# EAGLE design ADC (EAGLE 9.2.0)
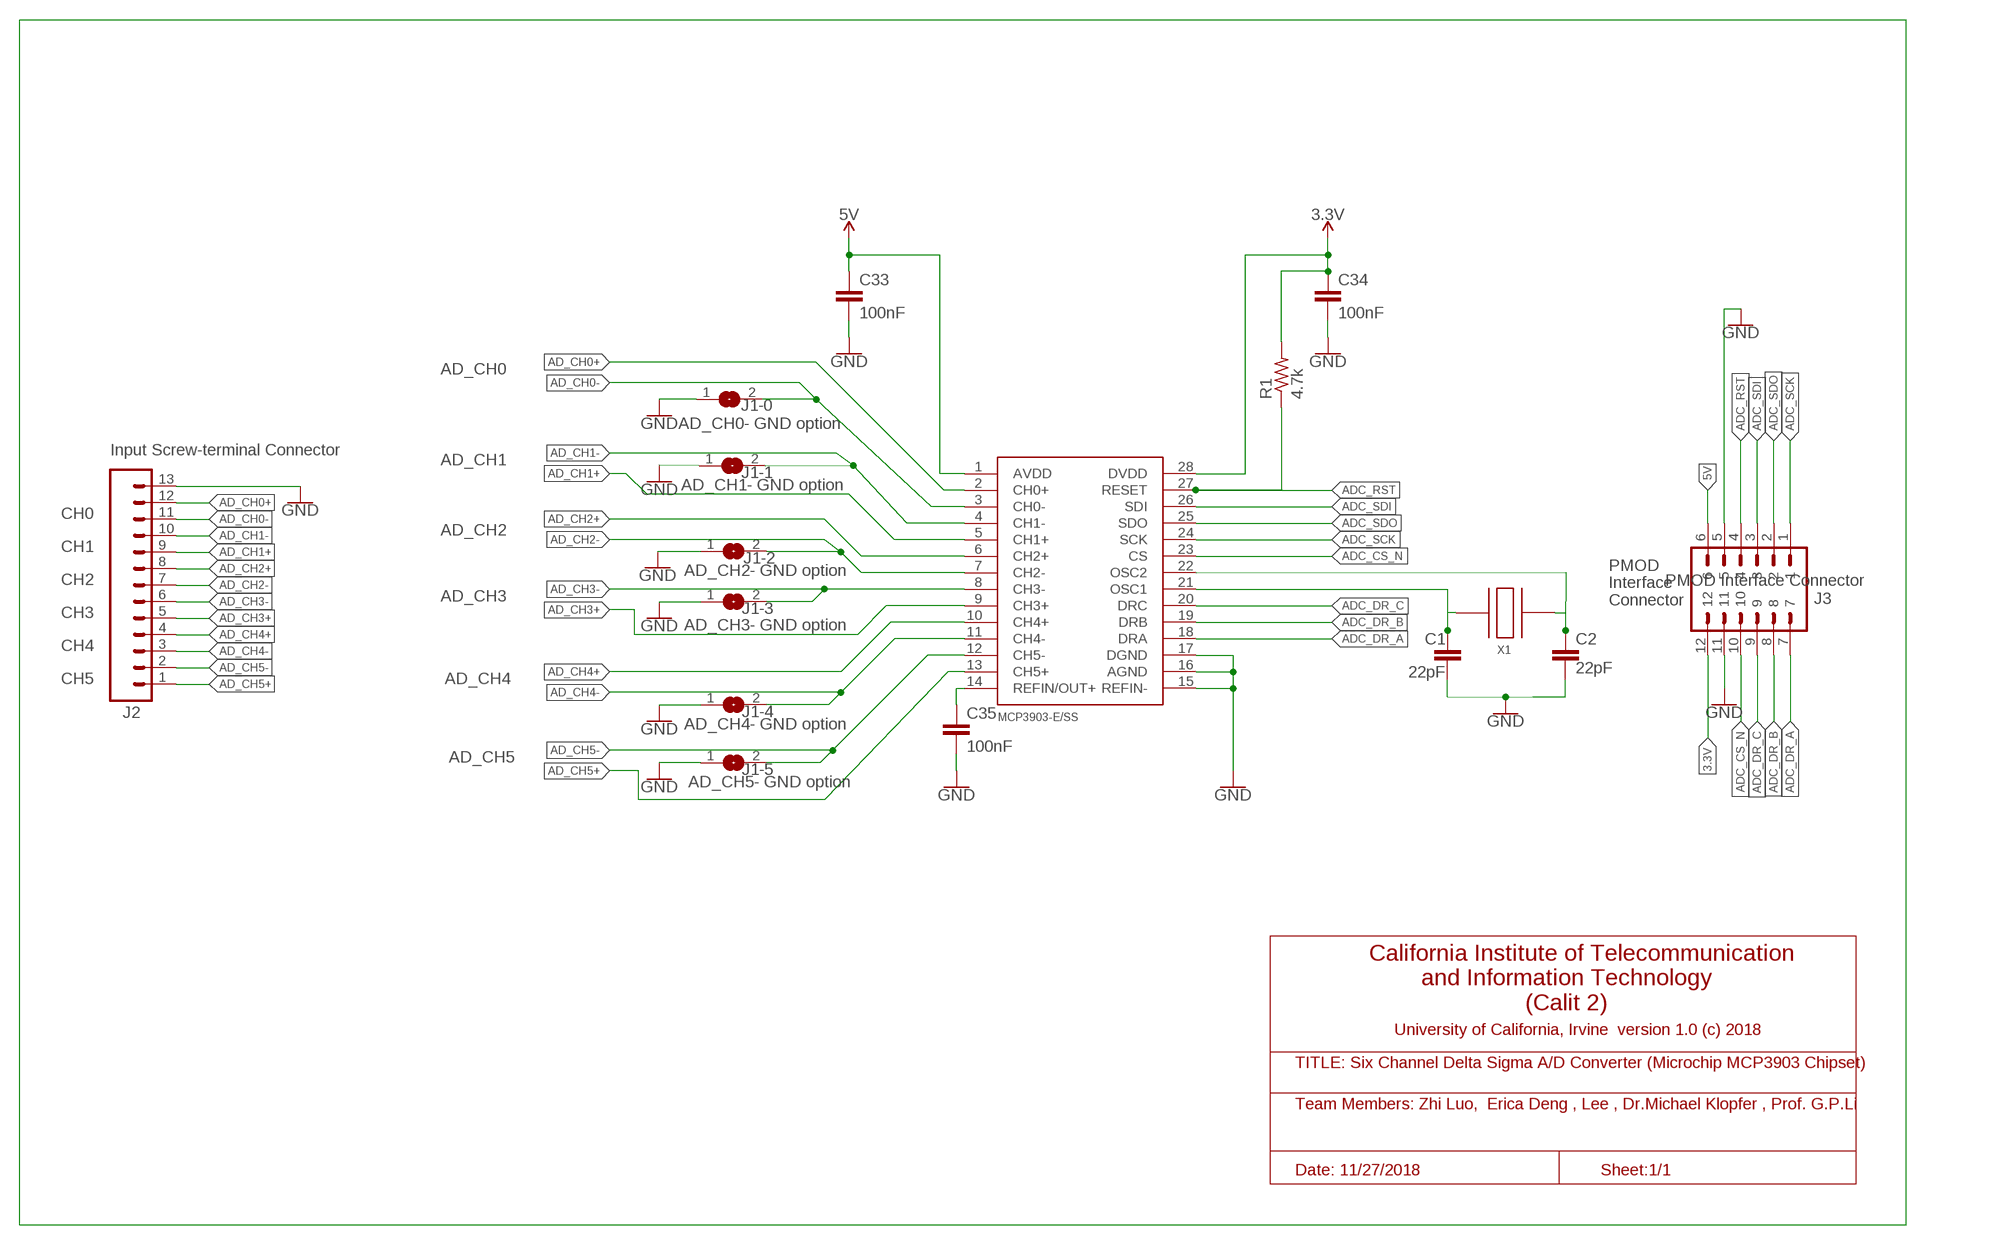
[diagram p0: schematic, sheet 1]

## Parts
C1  22pF  22PF-0603-50V-5%  [0603]
C2  22pF  22PF-0603-50V-5%  [0603]
C33  100nF  CC0603  [C0603]
C34  100nF  CC0603  [C0603]
C35  100nF  CC0603  [C0603]
J1-0  AD_CH0- GND option  SJ  [SJ]
J1-1  AD_CH1- GND option  SJ  [SJ]
J1-2  AD_CH2- GND option  SJ  [SJ]
J1-3  AD_CH3- GND option  SJ  [SJ]
J1-4  AD_CH4- GND option  SJ  [SJ]
J1-5  AD_CH5- GND option  SJ  [SJ]
J2  Input Screw-terminal Connector  CONN_13  [1X13]
J3  PMOD Interface Connector  26HEADER  [2*6HEADER]
R1  4.7k  0402-RES  [0402-RES]
U$1  MCP3903  [28-LEADSSOP]
X1  4MHZ  QUARTZ_3.58M_2PIN  [HC-49S]

## Nets
3.3V: C34.1 J3.12 R1.2 U$1.28(DVDD)
5V: C33.1 J3.6 U$1.1(AVDD)
AD_CH0+: J2.12 U$1.2(CH0+)
AD_CH0-: J1-0.2 J2.11 U$1.3(CH0-)
AD_CH1+: J2.9 U$1.5(CH1+)
AD_CH1-: J1-1.2 J2.10 U$1.4(CH1-)
AD_CH2+: J2.8 U$1.6(CH2+)
AD_CH2-: J1-2.2 J2.7 U$1.7(CH2-)
AD_CH3+: J2.5 U$1.9(CH3+)
AD_CH3-: J1-3.2 J2.6 U$1.8(CH3-)
AD_CH4+: J2.4 U$1.10(CH4+)
AD_CH4-: J1-4.2 J2.3 U$1.11(CH4-)
AD_CH5+: J2.1 U$1.13(CH5+)
AD_CH5-: J1-5.2 J2.2 U$1.12(CH5-)
ADC_CS_N: J3.10 U$1.23(CS)
ADC_DR_A: J3.7 U$1.18(DRA)
ADC_DR_B: J3.8 U$1.19(DRB)
ADC_DR_C: J3.9 U$1.20(DRC)
ADC_RST: J3.4 R1.1 U$1.27(RESET)
ADC_SCK: J3.1 U$1.24(SCK)
ADC_SDI: J3.3 U$1.26(SDI)
ADC_SDO: J3.2 U$1.25(SDO)
GND: C1.2 C33.2 C34.2 C35.2 J1-0.1 J1-1.1 J1-2.1 J1-3.1 J1-4.1 J1-5.1 J2.13 J3.5 J3.11 U$1.15(REFIN-) U$1.16(AGND) U$1.17(DGND)
N$1: C2.2
N$2: C35.1 U$1.14(REFIN/OUT+)
OSC_1: C1.1 U$1.21(OSC1) X1.1
OSC_2: C2.1 U$1.22(OSC2) X1.2

## Notes on the sheet
- AD_CH0
- AD_CH1
- CH0
- AD_CH2
- CH1
- CH2
- AD_CH3
- PMOD 
  Interface
  Connector
- CH3
- CH4
- CH5 | AD_CH4
- AD_CH5
- California Institute of Telecommunication 
          and Information Technology 
                          (Calit 2)
- University of California, Irvine  version 1.0 (c) 2018
- TITLE: Six Channel Delta Sigma A/D Converter (Microchip MCP3903 Chipset)
- Team Members: Zhi Luo,  Erica Deng , Lee , Dr.Michael Klopfer , Prof. G.P.Li
- Date: 11/27/2018 | Sheet:1/1

## Library data of the parts
C1 C2 = SparkFun-Capacitors:22PF: 22pF ceramic capacitors A capacitor is a passive two-terminal electrical component used to store electrical energy temporarily in an electric field.; PROD_ID: CAP-07876
C33-C35 = eagle-ltspice:C: CAPACITOR, European symbol; SPICEMODEL: NONE; SPICEPREFIX: C
J1-0 J1-1-J1-5 = jumper:SJ: SMD solder JUMPER
J2 = SparkFun-Connectors:CONN_13: Multi connection point. Often used as Generic Header-pin footprint for 0.1 inch spaced/style header connections On any of the 0.1 inch spaced packages, you can populate with these: Break Away Headers - Straight <https://www.sparkfun.com/products/116> (PRT-00116) Break Away Male Headers - Right Angle <https://www.sparkfun.com/products/553> (PRT-00553) Female Headers <https://www.sparkfun.com/products/115> (PRT-00115) Break Away Headers - Machine Pin <https://www.sparkfun.com/products/117> (PRT-00117) Break Away Female Headers - Swiss Machine Pin <https://www.sparkfun.com/products/743> (PRT-00743) For SCREWTERMINALS and SPRING TERMINALS visit here: Screw Terimnals on SparkFun.com <https://www.sparkfun.com/search/results?term=Screw+Terminals> (5mm/3.5mm/2.54mm spacing) This device is also useful as a general connection point to wire up your design to another part of your project. Our various solder wires solder well into these plated through hole pads. Hook-Up Wire - Assortment (Stranded, 22 AWG) <https://www.sparkfun.com/products/11375> (PRT-11375) Hook-Up Wire - Assortment (Solid Core, 22 AWG) <https://www.sparkfun.com/products/11367> (PRT-11367) View the entire wire category on our website here <https://www.sparkfun.com/categories/141> Special notes: Molex polarized connector foot print use with SKU : PRT-08231 with associated crimp pins and housings. 1MM SMD Version SKU: PRT-10208 NOTES ON THE VARIANTS LOCK and LOCK_LONGPADS... This footprint was designed to help hold the alignment of a through-hole component (i.e. 6-pin header) while soldering it into place. You may notice that each hole has been shifted either up or down by 0.005 of an inch from it's more standard position (which is a perfectly straight line). This slight alteration caused the pins (the squares in the middle) to touch the edges of the holes. Because they are alternating, it causes a "brace" to hold the component in place. 0.005 has proven to be the perfect amount of "off-center" position when using our standard breakaway headers. Although looks a little odd when you look at the bare footprint, once you have a header in there, the alteration is very hard to notice. Also,if you push a header all the way into place, it is covered up entirely on the bottom side.
J3 = MCP3903:2*6HEADER
R1 = Nizanlib:0402-RES
U$1 = MCP3903:MCP3903
X1 = CalPlug:QUARTZ_3.58M_2PIN; DIGIKEY: http://www.digikey.com/product-detail/en/txc-corporation/9C-3.579545MBBK-T/887-2450-1-ND/4475440

## Net classes
0 default: width 0.305 mm, drill 0.508 mm, clearance 0.254 mm

## Board
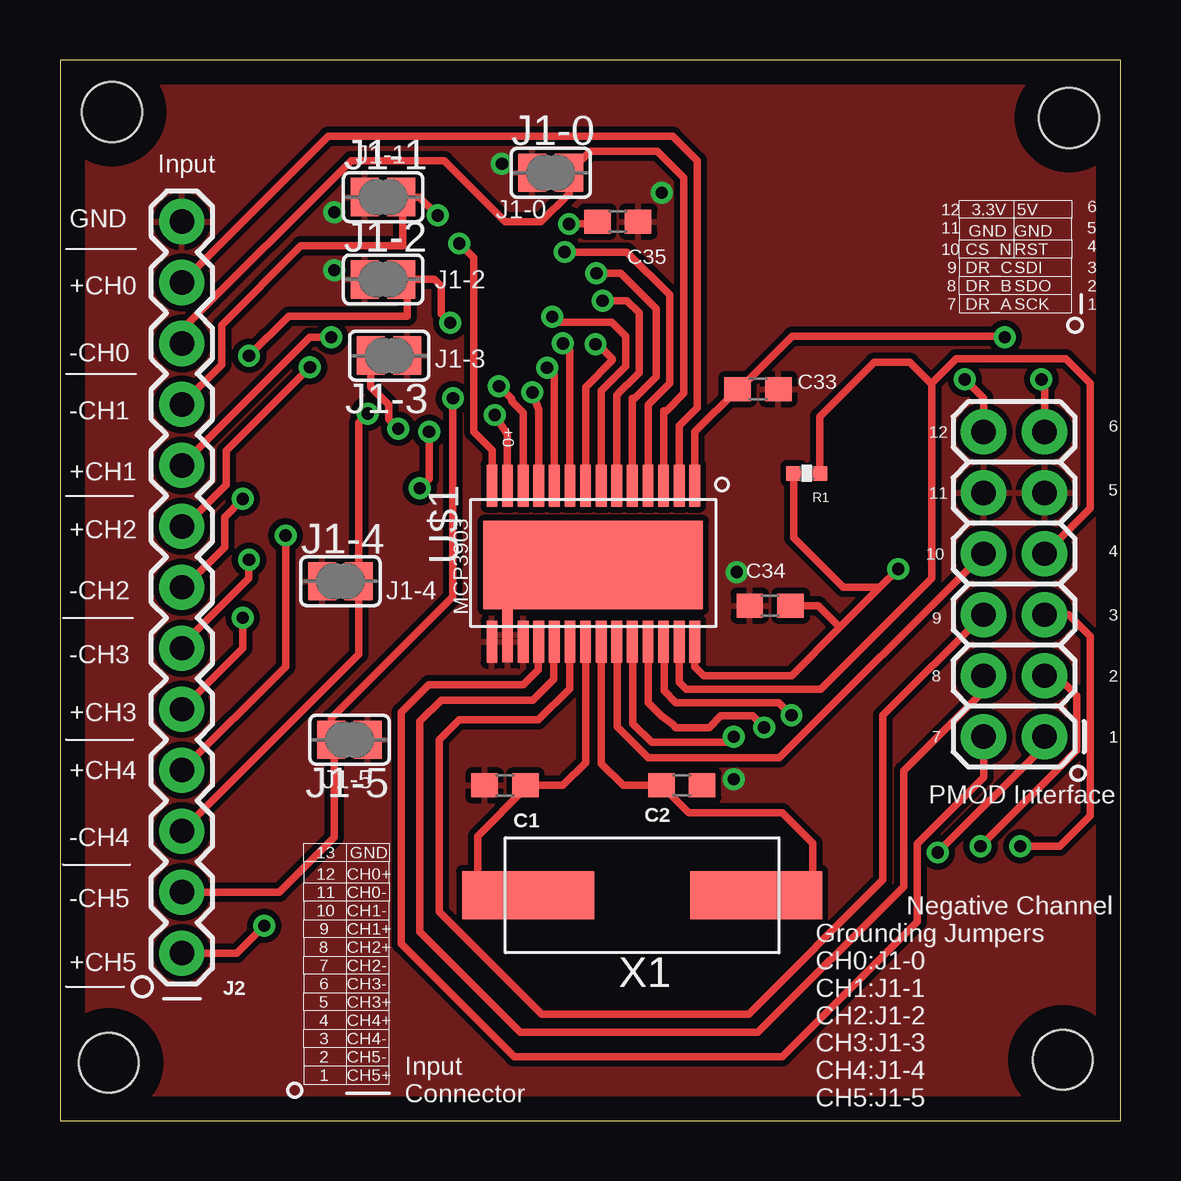
[diagram p1: board, top side]
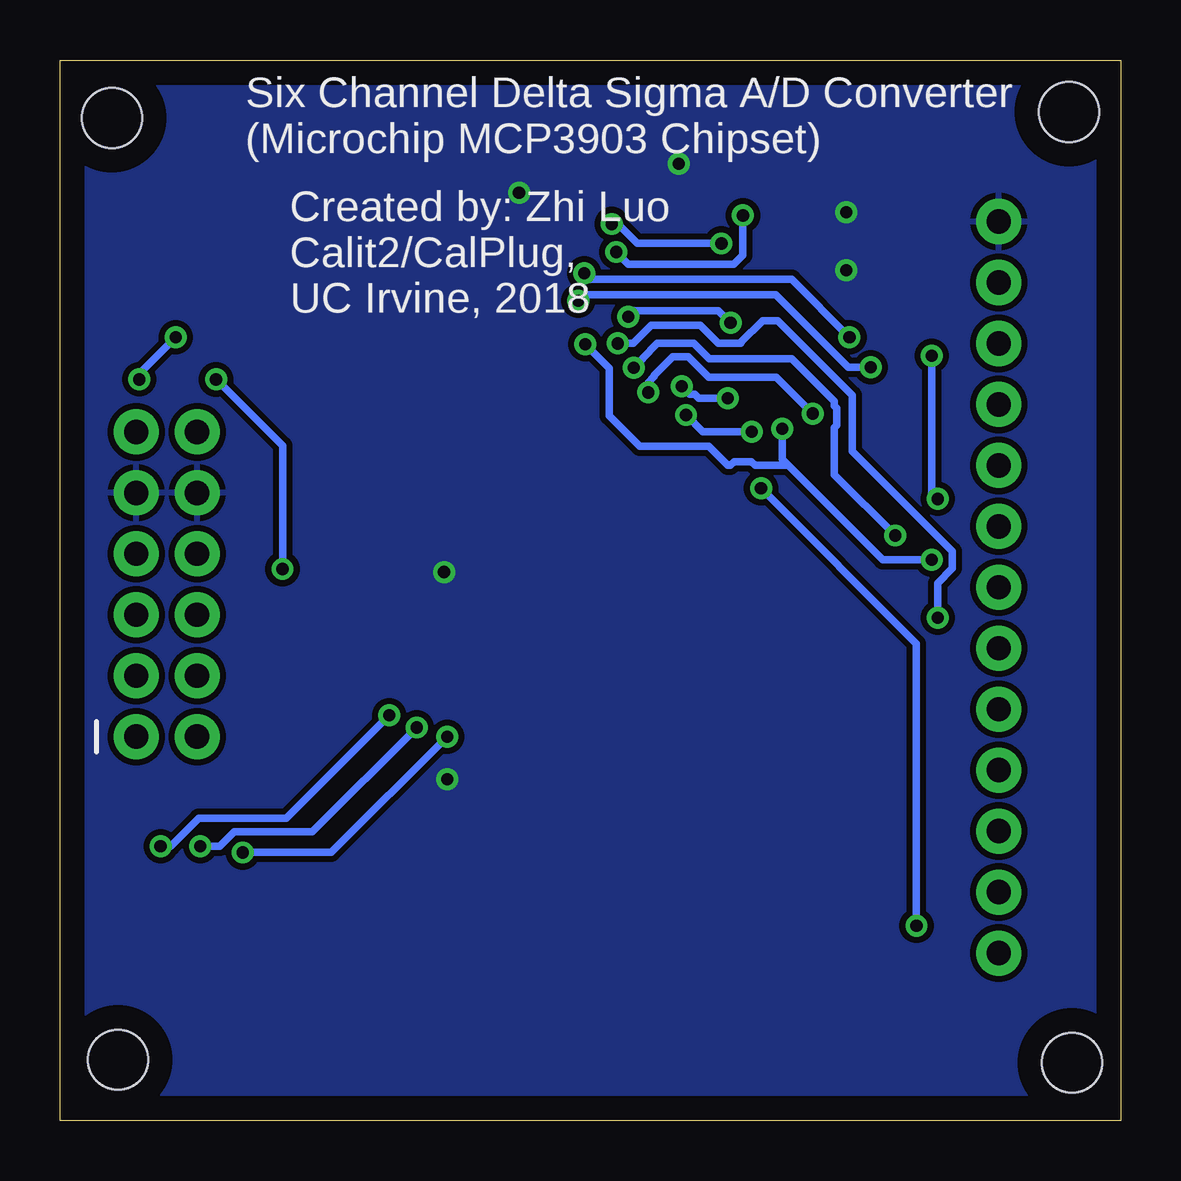
[diagram p2: board, bottom side, seen from below]

Size 44.2 x 44.2 mm. Coordinates in mm from the lower left corner, seen from the top.
Outline: 0,0 44.2,0 44.2,44.2 0,44.2 0,0
Copper layers (1*16): Top 0.035mm / dielectric 1.5mm / Bottom 0.035mm
Design rules "default": minimum track width 6mil, minimum drill 0.35mm, track to track 6mil, track to pad 6mil, pad to pad 6mil, via to via 6mil, smd to smd 6mil, copper to edge 40mil, drill to drill 6mil, minimum pad ring 10mil, minimum via ring 8mil, stop-mask expansion 4mil, vias tented up to drill 0mil, thermal gap 10mil
Holes 2.5 mm at 2.16,42.04 2.03,2.41 41.78,2.54 42.04,41.78

### Footprints (pad centres in the part's own frame; a part is rotated, then mirrored left to right if it is on the bottom)
0603 = smd 1.1 x 1: 1 -0.85,0; 2 0.85,0
C0603 = smd 1.1 x 1: 1 -0.85,0; 2 0.85,0
SJ = smd 1.168 x 1.6: 1 -0.762,0; 2 0.762,0
1X13 = drill 1.016 pad 1.88: 1 0,0; 2 2.54,0; 3 5.08,0; 4 7.62,0; 5 10.16,0; 6 12.7,0; 7 15.24,0; 8 17.78,0; 9 20.32,0; 10 22.86,0; 11 25.4,0; 12 27.94,0; 13 30.48,0
2*6HEADER = drill 1.016 pad 1.88: 1 6.35,1.27; 2 3.81,1.27; 3 1.27,1.27; 4 -1.27,1.27; 5 -3.81,1.27; 6 -6.35,1.27; 7 6.35,-1.27; 8 3.81,-1.27; 9 1.27,-1.27; 10 -1.27,-1.27; 11 -3.81,-1.27; 12 -6.35,-1.27
0402-RES = smd 0.6 x 0.6: 1 -0.55,0; 2 0.55,0
28-LEADSSOP = smd 9.144 x 3.683: 0 0.01,0.086 | smd 0.45 x 1.75: 1 -4.225,-3.225; 2 -3.575,-3.225; 3 -2.925,-3.225; 4 -2.275,-3.225; 5 -1.625,-3.225; 6 -0.975,-3.225; 7 -0.325,-3.225; 8 0.325,-3.225; 9 0.975,-3.225; 10 1.625,-3.225; 11 2.275,-3.225; 12 2.925,-3.225; 13 3.575,-3.225; 14 4.225,-3.225; 15 4.225,3.275; 17 2.925,3.275; 18 2.275,3.275; 19 1.625,3.275; 20 0.975,3.275; 21 0.325,3.275; 22 -0.325,3.275; 23 -0.975,3.275; 24 -1.625,3.275; 25 -2.275,3.275; 26 -2.925,3.275; 27 -3.575,3.275; 28 -4.225,3.275 | smd 0.45 x 2.286: 16 3.575,3.003
HC-49S = smd 5.5 x 2: 1 -4.75,0; 2 4.75,0

### Placement (x,y rotation side)
C1  18.54,13.97 180 top
C2  25.91,13.97 0 top
C33  29.08,30.48 0 top
C34  29.59,21.46 180 top
C35  23.24,37.47 0 top
J1-0  20.45,39.5 0 top
J1-1  13.46,38.48 0 top
J1-2  13.46,35.05 0 top
J1-3  13.72,31.88 180 top
J1-4  11.68,22.48 0 top
J1-5  12.07,15.88 180 top
J2  5.08,6.99 90 top
J3  39.75,22.35 270 top
R1  31.11,26.97 180 top
U$1  22.22,23.24 180 top
X1  24.26,9.4 0 top

### Tracks (layer width: path | path; a pad name or v marks a point on that pad's centre or on a via)
3.3V  (via drill 0.51)
  Top 0.305: U$1.28 26.45,18.92 26.83,18.54 30.48,18.54 32.49,20.55 | v34.93,22.99 34.16,22.23 | 34.16,22.23 32.49,20.55 | v37.7,30.89 38.48,30.1 J3.12 | 32.49,20.55 31.58,21.46 C34.1 | R1.2 30.56,24.3 32.64,22.23 34.16,22.23
  Bottom 0.305: v37.7,30.89 34.93,28.12 v34.93,22.99
5V  (via drill 0.51)
  Top 0.305: U$1.1 26.45,28.7 C33.1 28.31,30.48 30.52,32.69 39.32,32.69 v39.37,32.64 | v40.89,30.89 41.02,30.76 J3.6
  Bottom 0.305: v39.37,32.64 40.89,31.11 v40.89,30.89
AD_CH0+
  Top 0.305: U$1.2 25.8,28.96 26.54,29.7 26.54,40.01 25.53,41.02 11.18,41.02 J2.12
AD_CH0-
  Top 0.305: U$1.3 25.15,29.59 25.27,29.59 25.98,30.3 25.98,39.29 24.89,40.39 22.1,40.39 J1-0.2 21.21,38.63 20.04,37.47 18.54,37.47 16,40.01 12.14,40.01 5.08,32.95 J2.11
AD_CH1+  (via drill 0.51)
  Top 0.305: U$1.5 23.85,30.1 23.95,30.1 24.84,30.99 24.84,33.83 23.37,35.31 v22.35,35.31 | v11.3,32.64 10.41,32.64 J2.9
  Bottom 0.305: v22.35,35.31 22.1,35.05 13.72,35.05 v11.3,32.64
AD_CH1-  (via drill 0.51)
  Top 0.305: v21.02,36.2 23.62,36.2 25.4,34.42 25.4,30.73 24.5,29.83 U$1.4 | v15.74,37.72 14.98,38.48 J1-1.2 14.28,38.43 14.28,36.45 10.03,36.45 6.73,33.15 6.73,31.5 J2.10
  Bottom 0.305: v21.02,36.2 20.51,35.69 16.12,35.69 15.74,36.07 v15.74,37.72
AD_CH2+  (via drill 0.51)
  Top 0.305: U$1.6 23.2,30.23 23.29,30.32 23.29,30.33 23.62,30.66 23.63,30.66 24.13,31.16 24.13,33.66 23.62,34.16 v22.61,34.16 | J2.8 5.21,24.77 6.93,26.49 6.93,27.91 v10.41,31.39
  Bottom 0.305: v22.61,34.16 22.35,34.42 14.38,34.42 11.36,31.39 v10.41,31.39
AD_CH2-  (via drill 0.51)
  Top 0.305: U$1.7 22.55,30.42 23.57,31.45 23.57,32.69 22.99,33.27 20.74,33.27 v20.51,33.5 | v16.26,33.25 15.88,33.63 15.88,34.77 15.6,35.05 14.48,35.05 | 14.48,35.05 J1-2.2 | v7.87,31.88 9.53,33.53 14.48,33.53 14.48,35.05 | v7.62,25.91 6.86,25.15 6.86,23.9 5.18,22.23 J2.7
  Bottom 0.305: v20.51,33.5 20.26,33.76 16.76,33.76 v16.26,33.25 | v7.87,31.88 7.87,26.16 v7.62,25.91
AD_CH3+  (via drill 0.51)
  Top 0.305: U$1.9 21.23,26.48 21.23,32.11 v20.95,32.38 | v7.62,20.95 7.62,19.68 J2.5
  Bottom 0.305: v20.95,32.38 20.32,32.38 19.56,33.15 17.53,33.15 16.76,32.38 15.83,32.38 15.82,32.44 14.92,33.34 14.29,33.34 11.18,30.23 11.18,27.89 7.01,23.73 7.01,23.01 7.62,22.4 v7.62,20.95
AD_CH3-  (via drill 0.51)
  Top 0.305: J2.6 5.08,19.81 6.68,21.41 7.87,22.61 v7.87,23.37 | U$1.8 21.9,30.56 23.01,31.68 23.01,31.75 22.38,32.38 22.35,32.38 v22.31,32.35 | v14.1,28.83 13.69,29.23 13.69,29.82 12.95,30.56 J1-3.2
  Bottom 0.305: v22.31,32.35 21.31,31.34 21.31,29.37 20.03,28.09 17.17,28.09 16.38,27.3 16.27,27.3 16.11,27.46 15.39,27.46 15.23,27.3 13.84,27.3 | 13.84,27.3 9.91,23.37 v7.87,23.37 | 13.84,27.3 14.1,27.56 v14.1,28.83
AD_CH4+  (via drill 0.51)
  Top 0.305: U$1.10 20.6,31.06 v20.29,31.37 | v9.4,24.38 9.4,18.92 J2.4
  Bottom 0.305: v20.29,31.37 19.91,31.75 19.91,31.77 19.3,32.38 17.78,32.38 17.14,31.75 13.72,31.75 11.94,29.97 11.94,29.8 11.84,29.7 11.84,28.98 11.94,28.88 11.94,26.92 v9.4,24.38
AD_CH4-  (via drill 0.51)
  Top 0.305: U$1.11 19.95,29.62 v19.68,30.34 | v12.83,29.46 12.45,29.08 J1-4.2 12.45,19.43 J2.3
  Bottom 0.305: v12.83,29.46 14.34,30.98 17.16,30.98 18.01,31.83 18.67,31.83 19.43,31.06 19.43,31.01 19.68,30.76 v19.68,30.34
AD_CH5+  (via drill 0.51)
  Top 0.305: U$1.13 18.63,26.48 18.63,28.6 v18.11,29.41 | J2.1 7.37,6.99 v8.51,8.13 | v15.38,28.71 15.38,26.74 v14.99,26.35
  Bottom 0.305: v8.51,8.13 8.51,19.87 v14.99,26.35 | v18.11,29.41 17.42,28.71 v15.38,28.71
AD_CH5-  (via drill 0.51)
  Top 0.305: J2.2 9.14,9.53 11.43,11.81 11.43,15.75 J1-5.2 11.3,16.76 16.37,21.84 v16.37,30.1 | U$1.12 19.3,29.51 18.82,29.99 18.82,30.07 v18.29,30.61
  Bottom 0.305: v18.29,30.61 17.95,30.27 17.75,30.27 17.58,30.1 v16.37,30.1
ADC_CS_N
  Top 0.305: U$1.23 23.22,19.95 23.22,16.41 24.51,15.11 29.97,15.11 J3.10
ADC_DR_A
  Top 0.305: U$1.18 19.93,19.95 19.93,18.8 19.3,18.16 15.37,18.16 14.22,17.02 14.22,7.37 18.92,2.67 30.1,2.67 35.71,8.28 35.71,11.53 38.48,14.3 J3.7
ADC_DR_B
  Top 0.305: U$1.19 20.58,19.95 20.58,18.4 19.71,17.53 15.88,17.53 14.99,16.64 14.99,7.87 19.18,3.68 29.08,3.68 35.15,9.75 35.15,14.58 38.48,17.91 J3.8
ADC_DR_C
  Top 0.305: U$1.20 21.23,19.95 21.23,18.01 19.94,16.71 16.64,16.71 15.8,15.88 15.8,8.71 20.07,4.45 28.7,4.45 34.29,10.03 34.29,16.89 J3.9
ADC_RST
  Top 0.305: U$1.27 25.8,18.27 26.09,17.98 31.7,17.98 36.32,22.61 36.32,30.68 | 36.32,30.68 36.32,30.73 37.34,31.75 41.91,31.75 42.93,30.73 42.93,25.53 J3.4 | R1.1 31.66,29.33 33.93,31.6 35.41,31.6 36.32,30.68
ADC_SCK  (via drill 0.51)
  Top 0.305: U$1.24 23.87,19.95 23.87,16.55 24.65,15.76 27.83,15.76 v28.07,16 | v36.58,11.18 41.02,15.62 J3.1
  Bottom 0.305: v28.07,16 32.89,11.18 v36.58,11.18
ADC_SDI  (via drill 0.51)
  Top 0.305: U$1.26 25.17,19.95 25.17,17.91 25.65,17.42 29.95,17.42 v30.48,16.89 | J3.3 42.04,21.08 42.93,20.19 42.93,12.7 41.66,11.43 v40.01,11.43
  Bottom 0.305: v30.48,16.89 34.77,12.6 38.41,12.6 39.58,11.43 v40.01,11.43
ADC_SDO  (via drill 0.51)
  Top 0.305: U$1.25 24.5,17.41 25.04,16.87 25.53,16.51 25.65,16.38 27.05,16.38 27.53,16.87 28.85,16.87 v29.34,16.38 | J3.2 41.53,18.54 42.37,17.7 42.37,15.44 v38.35,11.43
  Bottom 0.305: v38.35,11.43 37.54,11.43 36.93,12.04 33.68,12.04 v29.34,16.38
GND  (via drill 0.51)
  other vias: 28.07,14.22 28.19,22.86 11.43,37.85 11.43,35.43 18.41,39.88 25.07,38.66
  pour Bottom: -0.13,44.32 44.32,44.32 44.32,-0.13 -0.13,-0.13
  pour Top: -0.13,44.32 44.32,44.32 44.32,-0.25 -0.13,-0.25
N$2  (via drill 0.51)
  Top 0.305: v16.64,36.55 17.24,35.95 17.24,28.7 18,27.94 U$1.14 | v21.21,37.36 22.29,37.36 C35.1
  Bottom 0.305: v16.64,36.55 20.14,36.55 20.95,37.36 v21.21,37.36
OSC_1
  Top 0.305: 19.52,9.41 X1.1 18.03,9.4 17.4,10.03 17.4,11.85 19.39,13.84 C1.1 20.95,13.97 21.9,14.91 U$1.21
OSC_2
  Top 0.305: U$1.22 22.55,14.88 23.46,13.97 C2.1 | C2.1 24.98,13.97 | C2.1 26.2,12.83 30.1,12.83 31.37,11.56 31.37,10.29 30.48,9.4 X1.2

### Text on the board
tPlace: J1-1 | Input | J1-0 | 12 | 3.3V | 5V | 6 | GND | 11 | GND | GND | 5 | 10 | CS_N | RST | 4 | J1-2 | 8 | 9 | DR_B | DR_C | SDI | SDO | 2 | 3 | +CH0 | 7 | DR_A | SCK | 1 | -CH0 | J1-3 | -CH1 | 6 | 0+ | 12 | +CH1 | 11 | 5 | +CH2 | 10 | 4 | -CH2 | J1-4 | 9 | 3 | -CH3 | 8 | 2 | +CH3 | 7 | 1 | +CH4 | J1-5 | PMOD Interface | -CH4 | 13 | GND | 12 | CH0+ | -CH5 | 10 | 11 | CH0- | CH1- | 9 | CH1+ | 8 | CH2+ | +CH5 | 7 | CH2- | 5 | 6 | CH3+ | CH3- | 4 | CH4+ | 3 | CH4- | 1 | 2 | CH5+ | CH5- | Input / Connector | Negative Channel / Grounding Jumpers / CH0:J1-0 / CH1:J1-1 / CH2:J1-2 / CH3:J1-3 / CH4:J1-4 / CH5:J1-5
bPlace: Six Channel Delta Sigma A/D Converter / (Microchip MCP3903 Chipset) | Created by: Zhi Luo / Calit2/CalPlug, / UC Irvine, 2018